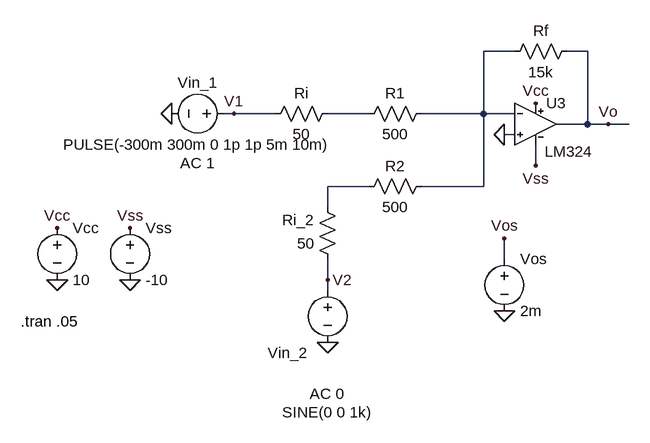
[diagram p0: schematic tp2_a.asc]
tp2_a.asc, the LTspice schematic file:
Version 4
SHEET 1 880 680
WIRE 64 32 16 32
WIRE 176 32 144 32
WIRE -368 128 -384 128
WIRE -304 128 -368 128
WIRE -160 128 -224 128
WIRE 16 128 16 32
WIRE 16 128 -80 128
WIRE 64 128 16 128
WIRE 176 144 176 32
WIRE 176 144 128 144
WIRE 208 144 176 144
WIRE 240 144 208 144
WIRE 64 160 48 160
WIRE 96 208 96 176
WIRE -160 240 -224 240
WIRE 16 240 16 128
WIRE 16 240 -80 240
WIRE -224 272 -224 240
WIRE 48 352 48 320
WIRE -224 384 -224 352
WIRE -224 400 -224 384
FLAG 96 208 Vss
FLAG -528 304 Vss
FLAG -640 304 Vcc
FLAG 96 112 Vcc
FLAG -640 384 0
FLAG -528 384 0
FLAG -464 128 0
FLAG -224 480 0
FLAG 208 144 Vo
FLAG -368 128 V1
FLAG -224 384 V2
FLAG 48 432 0
FLAG 48 320 Vos
FLAG 48 160 0
SYMBOL res 160 16 R90
WINDOW 0 0 56 VBottom 2
WINDOW 3 32 56 VTop 2
SYMATTR InstName Rf
SYMATTR Value 15k
SYMATTR SpiceLine tol=10
SYMBOL voltage -368 128 R90
WINDOW 0 -32 56 VBottom 2
WINDOW 3 32 56 VTop 2
WINDOW 123 60 56 VTop 2
WINDOW 39 0 0 Left 0
SYMATTR InstName Vin_1
SYMATTR Value PULSE(-300m 300m 0 1p 1p 5m 10m)
SYMATTR Value2 AC 1
SYMBOL voltage -640 288 R0
WINDOW 123 0 0 Left 0
WINDOW 39 0 0 Left 0
SYMATTR InstName Vcc
SYMATTR Value 10
SYMBOL voltage -528 288 R0
WINDOW 123 0 0 Left 0
WINDOW 39 0 0 Left 0
SYMATTR InstName Vss
SYMATTR Value -10
SYMBOL voltage -224 384 R0
WINDOW 0 -61 128 Bottom 2
WINDOW 3 -1 188 Top 2
WINDOW 123 -1 160 Top 2
WINDOW 39 0 0 Left 0
SYMATTR InstName Vin_2
SYMATTR Value SINE(0 0 1k)
SYMATTR Value2 AC 0
SYMBOL AutoGenerated\\LM324 96 144 R0
WINDOW 3 51 27 Top 2
SYMATTR InstName U3
SYMBOL res -64 112 R90
WINDOW 0 0 56 VBottom 2
WINDOW 3 32 56 VTop 2
SYMATTR InstName R1
SYMATTR Value 500
SYMATTR SpiceLine tol=10
SYMBOL res -64 224 R90
WINDOW 0 0 56 VBottom 2
WINDOW 3 32 56 VTop 2
SYMATTR InstName R2
SYMATTR Value 500
SYMBOL res -208 368 R180
WINDOW 0 36 76 Left 2
WINDOW 3 36 40 Left 2
SYMATTR InstName Ri_2
SYMATTR Value 50
SYMBOL res -320 144 R270
WINDOW 0 32 56 VTop 2
WINDOW 3 0 56 VBottom 2
SYMATTR InstName Ri
SYMATTR Value 50
SYMATTR SpiceLine tol=10
SYMBOL voltage 48 336 R0
WINDOW 123 0 0 Left 0
WINDOW 39 0 0 Left 0
SYMATTR InstName Vos
SYMATTR Value 2m
TEXT -696 448 Left 2 !.tran .05

The netlist it stands for:
* tp2_a.asc
Rf Vo N001 15k tol=10
Vin_1 V1 0 PULSE(-300m 300m 0 1p 1p 5m 10m) AC 1
Vcc Vcc 0 10
Vss Vss 0 -10
Vin_2 V2 0 SINE(0 0 1k) AC 0
XU3 0 N001 Vcc Vss Vo LM324  ; pins In+ In- V+ V- OUT
R1 N001 N002 500 tol=10
R2 N001 N003 500
Ri_2 V2 N003 50
Ri V1 N002 50 tol=10
Vos Vos 0 2m
.tran .05
.lib E:\LtSpice_components\LM324.ti.lib
.backanno
.end